# Altium schematic sheet battery_monitor.SchDoc
size A
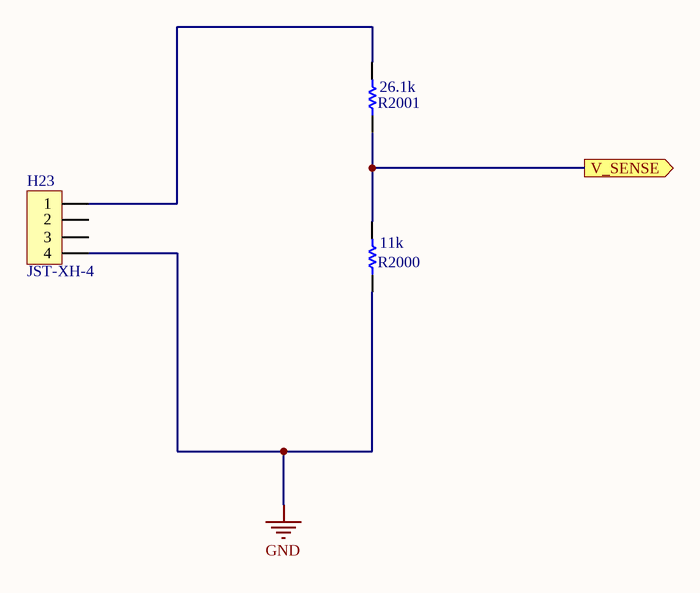
[diagram p0: battery_monitor.SchDoc]

## Parts
H23  JST-XH-4  [JST-XH-4]
R2000  value 11k  [RESC0805(2012)_M]  (hidden comment: 11K 1% 0805(2012))
R2001  value 26.1k  [RESC0805(2012)_N]  (hidden comment: 26K1 1% 0805(2012))

## Ports
V_SENSE (out)

## Nets
GND: H23.4 R2000.1
V_SENSE: R2000.2 R2001.1 ; port V_SENSE
NetH23_1: H23.1 R2001.2

Not connected (* = marked no-connect by the designer): H23 2 3

## Library data of the parts
R2000 = CMP-1013-00627-1: 11K 0.125W 1% 0805 (2012 Metric)  SMD; Case-Metric: 2012; Case-EIA: 0805; Tolerance: 1 %; Technology: SMT; Power: 0.125 W; Supplier 1: Digi-Key; Supplier Part Number 1: 311-11.0KCRCT-ND
R2001 = CMP-1013-00668-1: 26K1 0.125W 1% 0805 (2012 Metric)  SMD; Case-Metric: 2012; Case-EIA: 0805; Tolerance: 1 %; Power: 0.125 W; Technology: SMT; Supplier 1: Digi-Key; Supplier Part Number 1: 311-26.1KCRCT-ND
H23 = JST-XH-4: Supplier 1: Digi-Key; Supplier Part Number 1: 455-2262-1-ND